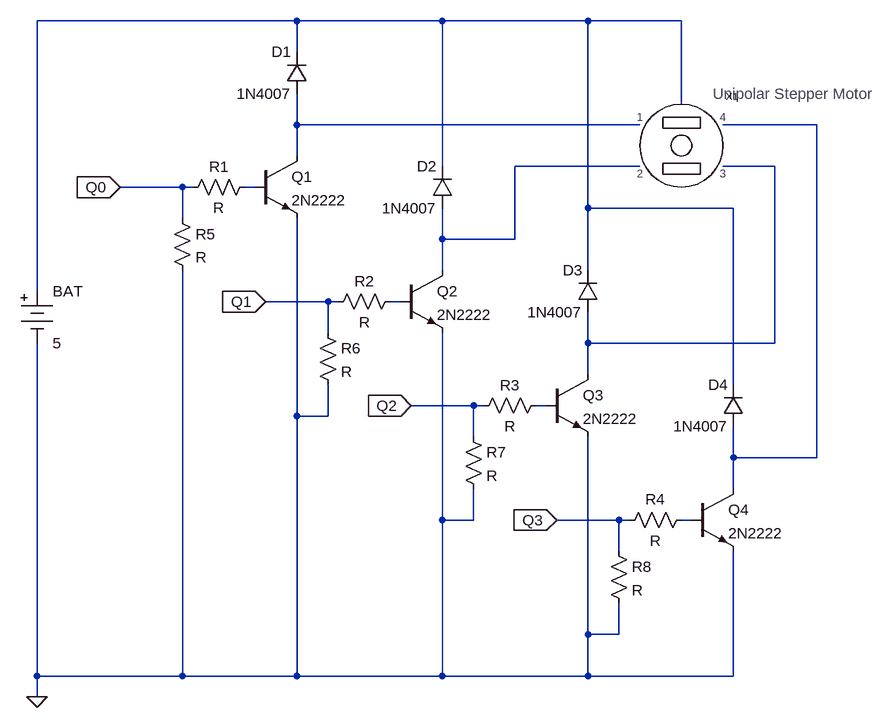
[diagram p0: schematic Stepper Motor Driver.asc]
Stepper Motor Driver.asc, the LTspice schematic file:
Version 4
SHEET 1 1044 724
WIRE 128 -336 -272 -336
WIRE 352 -336 128 -336
WIRE 576 -336 352 -336
WIRE 720 -336 576 -336
WIRE 128 -288 128 -336
WIRE 720 -208 720 -336
WIRE 128 -176 128 -224
WIRE 656 -176 128 -176
WIRE 928 -176 784 -176
WIRE 128 -128 128 -176
WIRE 352 -112 352 -336
WIRE 656 -112 464 -112
WIRE 864 -112 784 -112
WIRE -48 -80 -144 -80
WIRE -32 -80 -48 -80
WIRE 64 -80 48 -80
WIRE 576 -48 576 -336
WIRE 800 -48 576 -48
WIRE -48 -32 -48 -80
WIRE 352 0 352 -48
WIRE 464 0 464 -112
WIRE 464 0 352 0
WIRE 352 48 352 0
WIRE 576 48 576 -48
WIRE -272 80 -272 -336
WIRE 176 96 80 96
WIRE 192 96 176 96
WIRE 288 96 272 96
WIRE 176 144 176 96
WIRE 576 160 576 112
WIRE 864 160 864 -112
WIRE 864 160 576 160
WIRE 576 208 576 160
WIRE 800 224 800 -48
WIRE 400 256 304 256
WIRE 416 256 400 256
WIRE 512 256 496 256
WIRE 128 272 128 -32
WIRE 176 272 176 224
WIRE 176 272 128 272
WIRE 400 304 400 256
WIRE 800 336 800 288
WIRE 928 336 928 -176
WIRE 928 336 800 336
WIRE 800 384 800 336
WIRE 352 432 352 144
WIRE 400 432 400 384
WIRE 400 432 352 432
WIRE 624 432 528 432
WIRE 640 432 624 432
WIRE 736 432 720 432
WIRE 624 480 624 432
WIRE 576 608 576 304
WIRE 624 608 624 560
WIRE 624 608 576 608
WIRE -272 672 -272 160
WIRE -48 672 -48 48
WIRE -48 672 -272 672
WIRE 128 672 128 272
WIRE 128 672 -48 672
WIRE 352 672 352 432
WIRE 352 672 128 672
WIRE 576 672 576 608
WIRE 576 672 352 672
WIRE 800 672 800 480
WIRE 800 672 576 672
WIRE -272 704 -272 672
FLAG -272 704 0
FLAG -144 -80 Q0
IOPIN -144 -80 In
FLAG 80 96 Q1
IOPIN 80 96 In
FLAG 304 256 Q2
IOPIN 304 256 In
FLAG 528 432 Q3
IOPIN 528 432 In
SYMBOL npn2 64 -128 R0
SYMATTR InstName Q1
SYMATTR Value 2N2222
SYMBOL npn2 288 48 R0
SYMATTR InstName Q2
SYMATTR Value 2N2222
SYMBOL npn2 512 208 R0
SYMATTR InstName Q3
SYMATTR Value 2N2222
SYMBOL npn2 736 384 R0
SYMATTR InstName Q4
SYMATTR Value 2N2222
SYMBOL diode 144 -224 R180
WINDOW 0 24 64 Left 2
WINDOW 3 24 0 Left 2
SYMATTR InstName D1
SYMATTR Value 1N4007
SYMBOL diode 368 -48 R180
WINDOW 0 24 64 Left 2
WINDOW 3 24 0 Left 2
SYMATTR InstName D2
SYMATTR Value 1N4007
SYMBOL diode 592 112 R180
WINDOW 0 24 64 Left 2
WINDOW 3 24 0 Left 2
SYMATTR InstName D3
SYMATTR Value 1N4007
SYMBOL diode 816 288 R180
WINDOW 0 24 64 Left 2
WINDOW 3 24 0 Left 2
SYMATTR InstName D4
SYMATTR Value 1N4007
SYMBOL Misc\\battery -272 64 R0
SYMATTR InstName BAT
SYMATTR Value 5
SYMBOL res -48 -64 R270
WINDOW 0 32 56 VTop 2
WINDOW 3 0 56 VBottom 2
SYMATTR InstName R1
SYMBOL res 176 112 R270
WINDOW 0 32 56 VTop 2
WINDOW 3 0 56 VBottom 2
SYMATTR InstName R2
SYMBOL res 400 272 R270
WINDOW 0 32 56 VTop 2
WINDOW 3 0 56 VBottom 2
SYMATTR InstName R3
SYMBOL res 624 448 R270
WINDOW 0 32 56 VTop 2
WINDOW 3 0 56 VBottom 2
SYMATTR InstName R4
SYMBOL res 160 128 R0
SYMATTR InstName R6
SYMBOL res 384 288 R0
SYMATTR InstName R7
SYMBOL res 608 464 R0
SYMATTR InstName R8
SYMBOL res -64 -48 R0
SYMATTR InstName R5
SYMBOL StepperMotor 720 -144 R0
SYMATTR InstName X1

The netlist it stands for:
* Stepper Motor Driver.asc
Q1 N002 N006 0 0 2N2222
Q2 N004 N007 0 0 2N2222
Q3 N005 N008 0 0 2N2222
Q4 N003 N009 0 0 2N2222
D1 N002 N001 1N4007
D2 N004 N001 1N4007
D3 N005 N001 1N4007
D4 N003 N001 1N4007
V§BAT N001 0 5
R1 Q0 N006 R
R2 Q1 N007 R
R3 Q2 N008 R
R4 Q3 N009 R
R6 Q1 0 R
R7 Q2 0 R
R8 Q3 0 R
R5 Q0 0 R
XX1 N001 N002 N004 N005 N003 StepperMotor  ; pins Common 1 2 3 4
.model D D
.lib standard.dio
.model NPN NPN
.model PNP PNP
.lib standard.bjt
.backanno
.end